# Altium schematic sheet Input.SchDoc
size A4
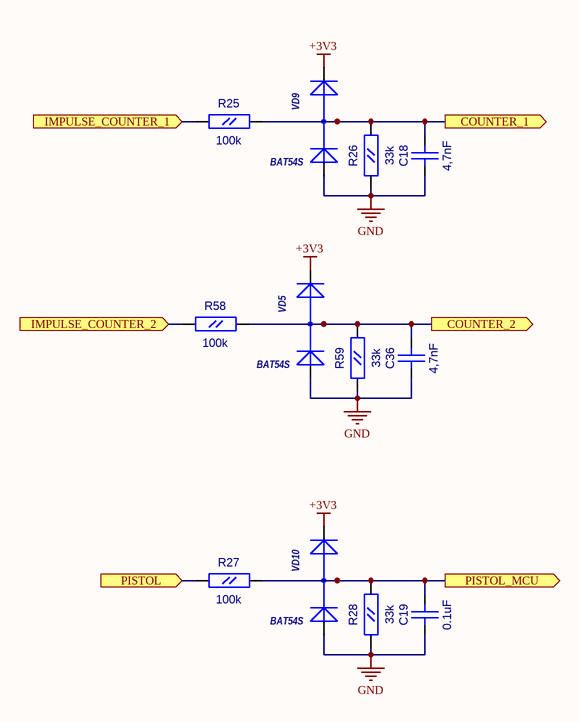
[diagram p0: Input.SchDoc]

## Parts
C18  4,7nF  [CC0603]
C19  0.1uF  [CC0603]
C36  4,7nF  [CC0603]
R25  100k  [RC0603]
R26  33k  [RC0603]
R27  100k  [RC0603]
R28  33k  [RC0603]
R58  100k  [RC0603]
R59  33k  [RC0603]
VD5  BAT54S  [SOT-23(GSD)]
VD9  BAT54S  [SOT-23(GSD)]
VD10  BAT54S  [SOT-23(GSD)]

## Ports
COUNTER_1 (out), COUNTER_2 (out), IMPULSE_COUNTER_1 (in), IMPULSE_COUNTER_2 (in), PISTOL (in), PISTOL_MCU (out)

## Nets
+3V3: VD5.2(K) VD9.2(K) VD10.2(K)
GND: C18.1(A) C19.1(A) C36.1(A) R26.1(A) R28.1(A) R59.1(A) VD5.1(A) VD9.1(A) VD10.1(A)
COUNTER_1: C18.2(B) R25.2(B) R26.2(B) VD9.3(AK) ; port COUNTER_1
COUNTER_2: C36.2(B) R58.2(B) R59.2(B) VD5.3(AK) ; port COUNTER_2
IMPULSE_COUNTER_1: R25.1(A) ; port IMPULSE_COUNTER_1
IMPULSE_COUNTER_2: R58.1(A) ; port IMPULSE_COUNTER_2
PISTOL: R27.1(A) ; port PISTOL
PISTOL_MCU: C19.2(B) R27.2(B) R28.2(B) VD10.3(AK) ; port PISTOL_MCU

## Library data of the parts
C18 C19 C36 = CC0603
  C18 C36: Value: 4,7nF
  C19: Value: 0.1uF
R25-R28 R58 R59 = RC0603
  R25 R27 R58: Value: 100k
  R26 R28 R59: Value: 33k
VD5 VD9 VD10 = BAT54S: 1.0 Ampere General Purpose Rectifier; ComponentField6: Published 8-Jun-2000, Modified 11-July-2000: SIM Model Added.; Value: *